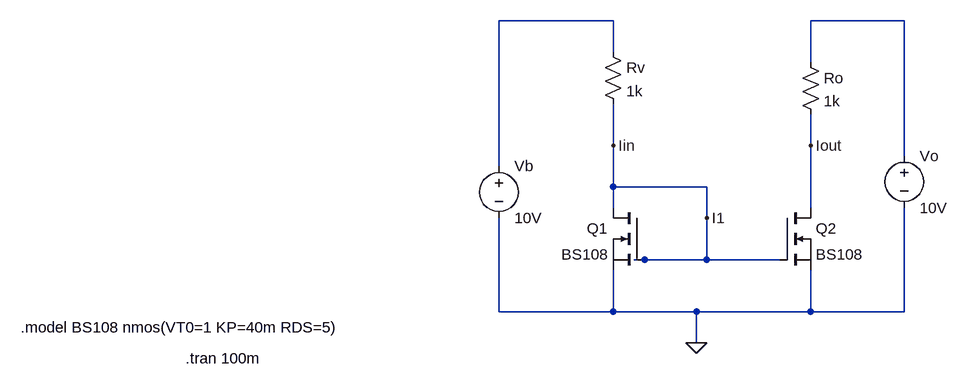
[diagram p0: schematic MOSFETCurrentMirror.asc]
MOSFETCurrentMirror.asc, the LTspice schematic file:
Version 4
SHEET 1 880 680
WIRE 64 -80 -112 -80
WIRE 512 -80 368 -80
WIRE 64 -32 64 -80
WIRE 368 -16 368 -80
WIRE 64 112 64 48
WIRE 368 112 368 64
WIRE 512 128 512 -80
WIRE -112 144 -112 -80
WIRE 64 176 64 112
WIRE 208 176 64 176
WIRE 64 208 64 176
WIRE 368 208 368 112
WIRE 208 224 208 176
WIRE 112 288 96 288
WIRE 208 288 208 224
WIRE 208 288 112 288
WIRE 320 288 208 288
WIRE -112 368 -112 224
WIRE 64 368 64 304
WIRE 64 368 -112 368
WIRE 192 368 64 368
WIRE 368 368 368 304
WIRE 368 368 192 368
WIRE 512 368 512 208
WIRE 512 368 368 368
WIRE 192 416 192 368
FLAG 208 224 I1
FLAG 192 416 0
FLAG 64 112 Iin
FLAG 368 112 Iout
SYMBOL nmos 320 208 R0
SYMATTR InstName Q2
SYMATTR Value BS108
SYMBOL nmos 112 208 M0
SYMATTR InstName Q1
SYMATTR Value BS108
SYMBOL voltage -112 128 R0
SYMATTR InstName Vb
SYMATTR Value 10V
SYMBOL voltage 512 112 R0
SYMATTR InstName Vo
SYMATTR Value 10V
SYMBOL res 48 -48 R0
SYMATTR InstName Rv
SYMATTR Value 1k
SYMBOL res 352 -32 R0
SYMATTR InstName Ro
SYMATTR Value 1k
TEXT -848 392 Left 2 !.model BS108 nmos(VT0=1 KP=40m RDS=5)
TEXT -594 440 Left 2 !.tran 100m

The netlist it stands for:
* MOSFETCurrentMirror.asc
M§Q2 Iout Iin 0 0 BS108
M§Q1 Iin Iin 0 0 BS108
Vb N001 0 10V
Vo N002 0 10V
Rv N001 Iin 1k
Ro N002 Iout 1k
.model NMOS NMOS
.model PMOS PMOS
.lib standard.mos
.model BS108 nmos(VT0=1 KP=40m RDS=5)
.tran 100m
.backanno
.end